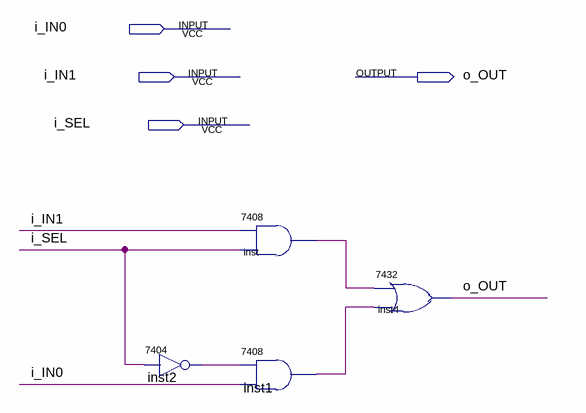
[diagram p0: schematic sheet]
// Quartus schematic mux_2x1.bdf as structural Verilog: 4 symbols, 4 pins
module mux_2x1 (
  input  i_IN0,
  input  i_IN1,
  input  i_SEL,
  output o_OUT
);

  wire inst1_1, inst2_1, inst_1;

  \7404  inst2 (.\2 (i_SEL), .\1 (inst2_1));
  \7408  inst (.\3 (i_SEL), .\2 (i_IN1), .\1 (inst_1));
  \7408  inst1 (.\3 (i_IN0), .\2 (inst2_1), .\1 (inst1_1));
  \7432  inst4 (.\2 (inst_1), .\3 (inst1_1), .\1 (o_OUT));
endmodule
